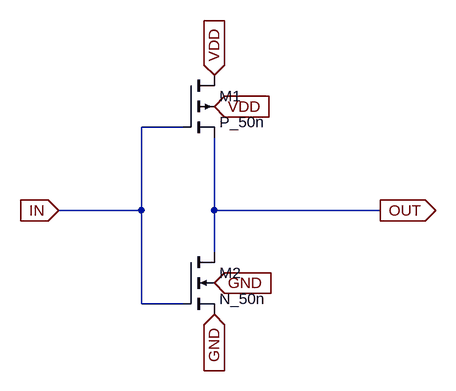
[diagram p0: schematic Inverter.asc]
Inverter.asc, the LTspice schematic file:
Version 4.1
SHEET 1 880 680
WIRE 192 160 128 160
WIRE 128 288 128 160
WIRE 128 288 0 288
WIRE 240 288 240 176
WIRE 496 288 240 288
WIRE 240 352 240 288
WIRE 128 432 128 288
WIRE 192 432 128 432
FLAG 240 400 GND
IOPIN 240 400 In
FLAG 240 448 GND
IOPIN 240 448 In
FLAG 240 80 VDD
IOPIN 240 80 In
FLAG 240 128 VDD
IOPIN 240 128 In
FLAG 0 288 IN
IOPIN 0 288 In
FLAG 496 288 OUT
IOPIN 496 288 Out
SYMBOL pmos4 192 80 R0
SYMATTR InstName M1
SYMATTR Value P_50n
SYMATTR Value2 l=50n w=6u
SYMBOL nmos4 192 352 R0
SYMATTR InstName M2
SYMATTR Value N_50n
SYMATTR Value2 l=50n w=2u

The netlist it stands for:
* Inverter.asc
M1 VDD IN OUT VDD P_50n l=50n w=6u
M2 OUT IN GND GND N_50n l=50n w=2u
.model NMOS NMOS
.model PMOS PMOS
.lib standard.mos
.backanno
.end